# Altium schematic sheet 3_Charging.SchDoc
size A4; SheetNumber: 4; SheetTotal: 12
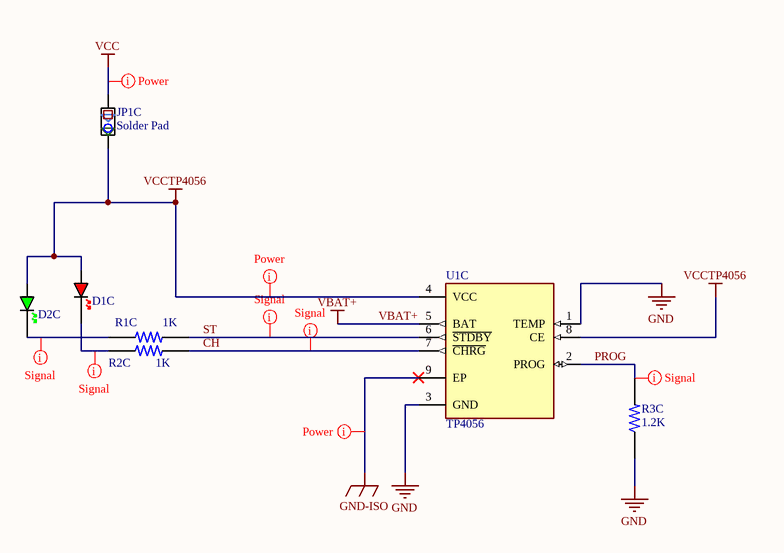
[diagram p0: 3_Charging.SchDoc]

## Parts
D1C  RED  [LED_0603_RED]  (value not drawn)
D2C  GREEN  [LED_0603_GREEN]  (value not drawn)
JP1C  Solder Pad  [Solder_Pad_2_Pin_NC_Medium]
R1C  1K  [R-0603]
R2C  1K  [R-0603]
R3C  1.2K  [R-0603]
U1C  TP4056  [TP4056]

## Nets
GND: R3C.1 U1C.1(TEMP) U1C.3(GND)
GND-ISO: U1C.9(EP)
VBAT+: U1C.5(BAT)
VCC: JP1C.1
VCCTP4056: D1C.A D2C.A JP1C.2 U1C.4(VCC) U1C.8(CE)
CH: R2C.2 U1C.7(~{CHRG})
PROG: R3C.2 U1C.2(PROG)
ST: R1C.2 U1C.6(~{STDBY})
NetD1C_K: D1C.K R2C.1
NetD2C_K: D2C.K R1C.1

## Layout directives
net class Power; rule Supply Nets [Voltage = 0.000]: GND-ISO, VCCTP4056
net class Signal: CH, NetD1C_K, NetD2C_K, PROG, ST
net class Power: VCC

## Library data of the parts
D1C = LED_0603_RED: LED 0603 RED SMD
D2C = LED_0603_GREEN: LED 0603 GREEN SMD
JP1C = Solder_Pad_2_Pin_NC_Medium: Solder Pad 2 Pin NC 1.016 mm Pitch
R1C R2C R3C = R-0603: 0603; MP: 2-1623703-0; Power_Rating: .1 W; Value: 10K; Tolerance: 1%; MF: TE Connectivity; Package: 0603; Price: None; Resistance: 10K; Check_prices: https://www.snapeda.com/parts/2-1623703-0/TE%20Connectivity/view-part/2213192/?ref=eda; SnapEDA_Link: https://www.snapeda.com/parts/2-1623703-0/TE%20Connectivity/view-part/2213192/?ref=snap; Availability: Warning
U1C = TP4056: Complete single cell Li-Ion battery with a constant current / constant voltage linear charger; Package: None; MP: TP4056; Value: *; Price: None; Availability: Unavailable